# EAGLE design board (EAGLE 6.4)
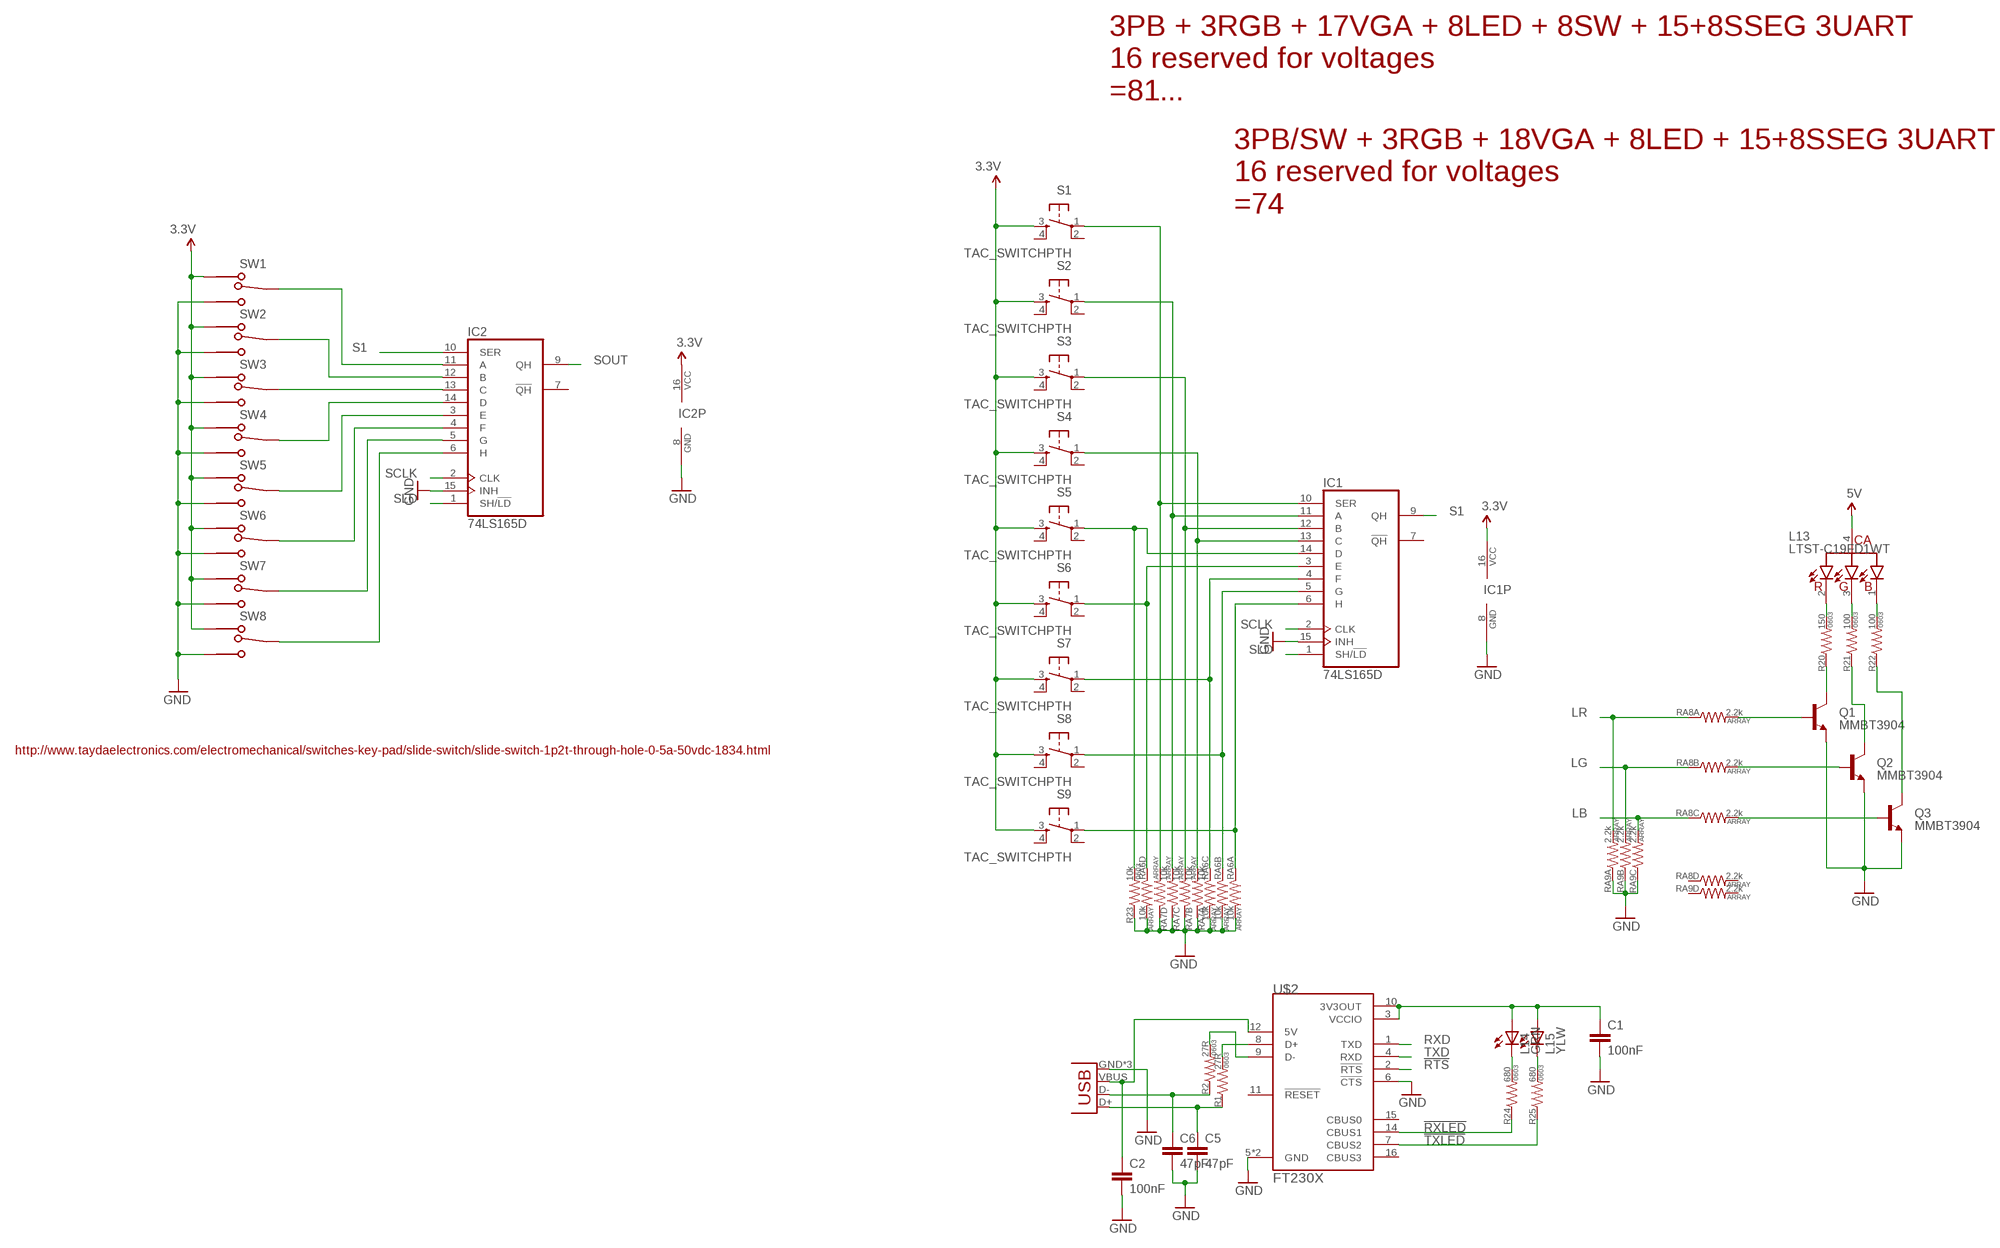
[diagram p0: schematic, sheet 1, part 1 of 3]
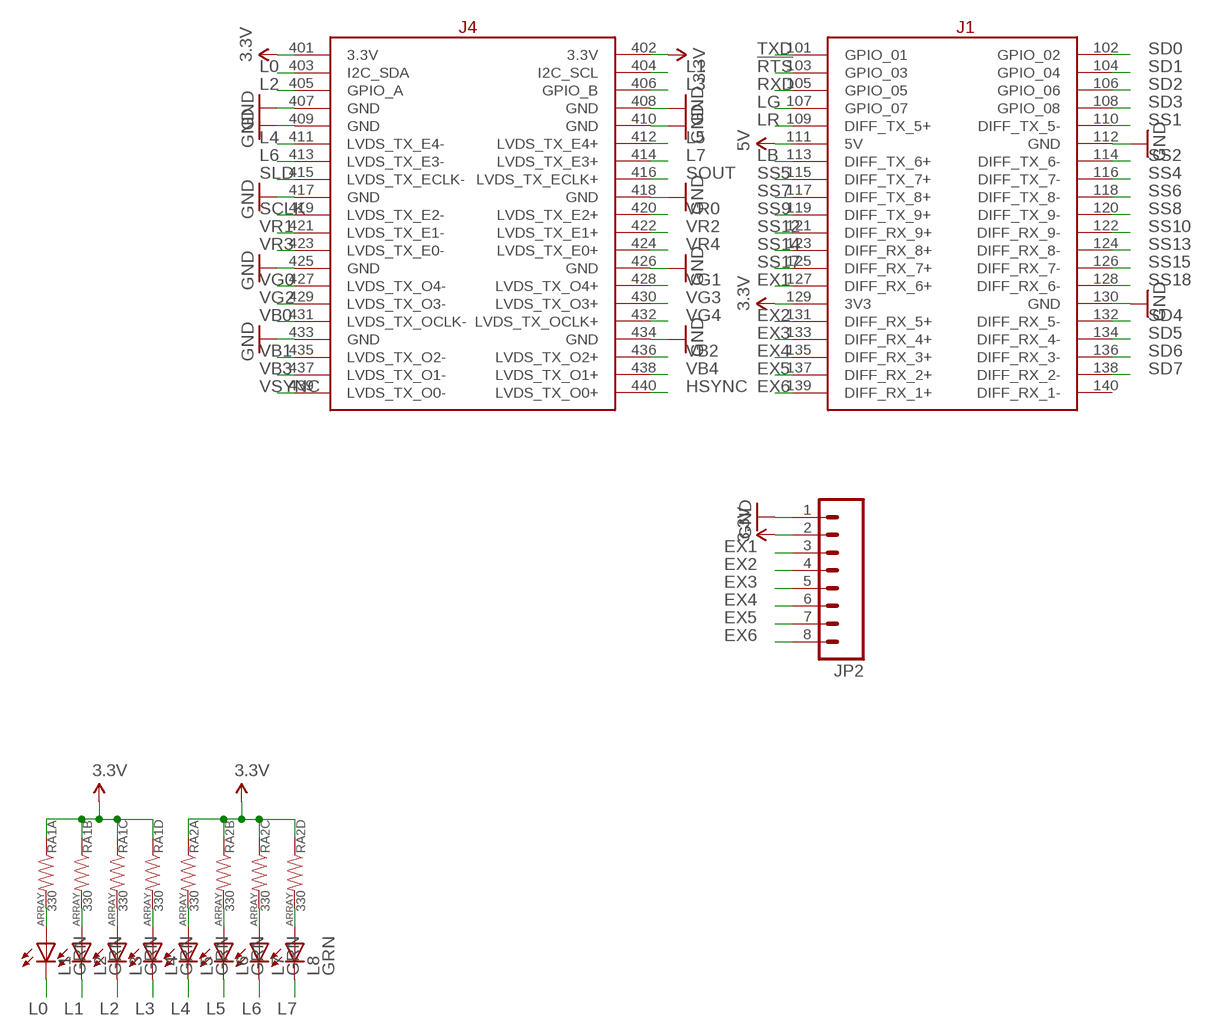
[diagram p1: schematic, sheet 1, part 2 of 3]
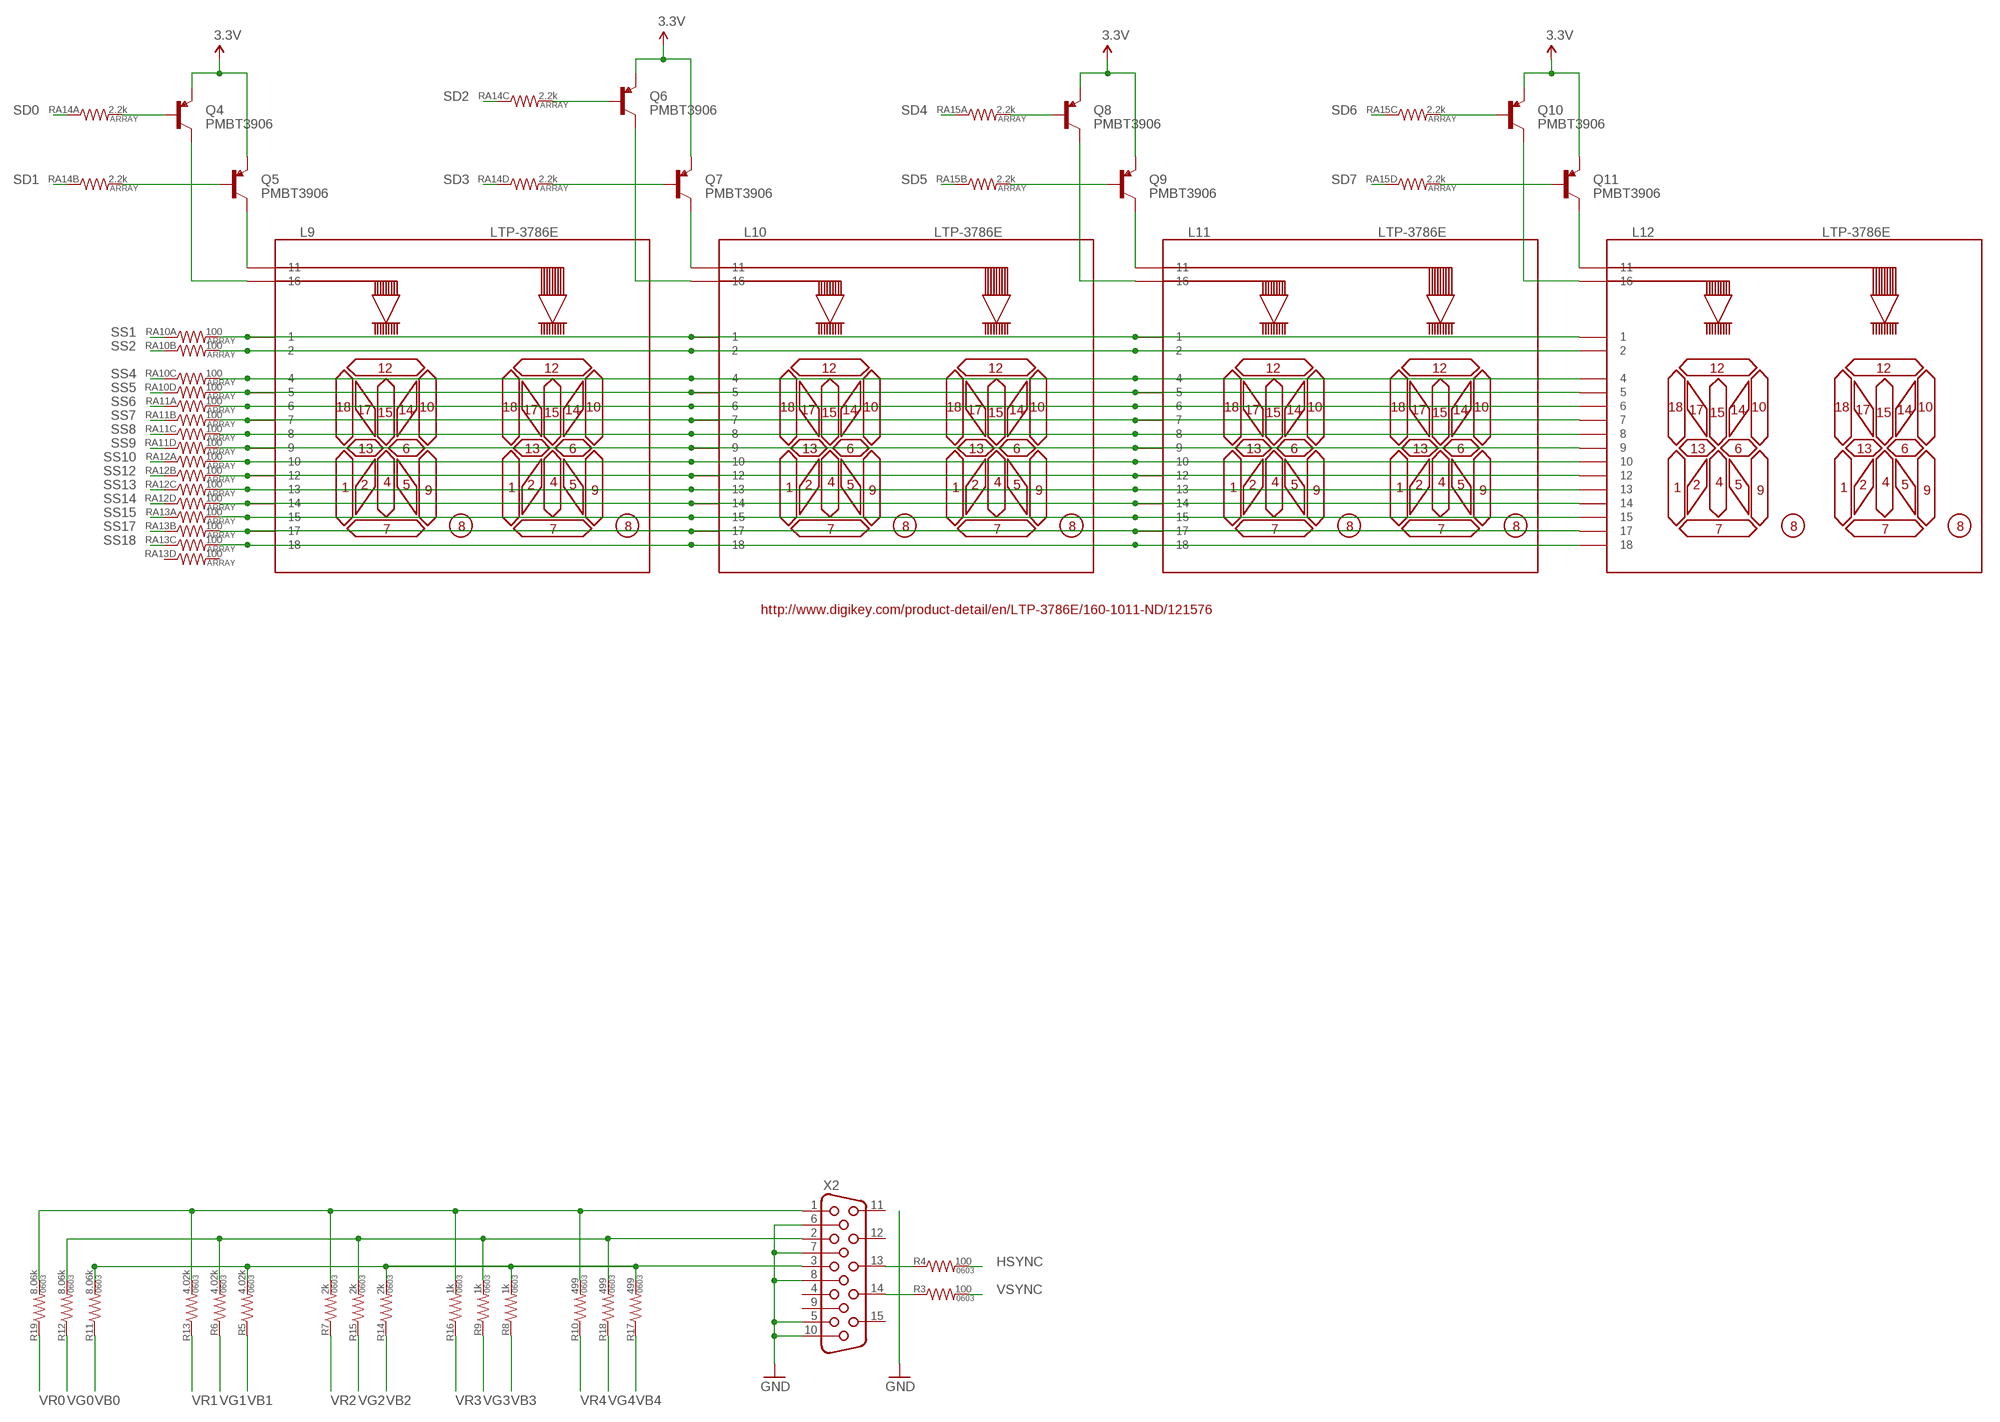
[diagram p2: schematic, sheet 1, part 3 of 3]

## Parts
C1  100nF  CAP0402-CAP  [0402-CAP]
C2  100nF  CAP0402-CAP  [0402-CAP]
C5  47pF  CAP0402-CAP  [0402-CAP]
C6  47pF  CAP0402-CAP  [0402-CAP]
IC1  74LS165D  [SO16]
IC2  74LS165D  [SO16]
JP1  USB-MICROB  [USB-MICROB]
JP2  M081X08  [1X08]
L1  GRN  LED0603  [0603_LED]
L2  GRN  LED0603  [0603_LED]
L3  GRN  LED0603  [0603_LED]
L4  GRN  LED0603  [0603_LED]
L5  GRN  LED0603  [0603_LED]
L6  GRN  LED0603  [0603_LED]
L7  GRN  LED0603  [0603_LED]
L8  GRN  LED0603  [0603_LED]
L9  LTP-3786E  LTP-3786  [LTP-378?]
L10  LTP-3786E  LTP-3786  [LTP-378?]
L11  LTP-3786E  LTP-3786  [LTP-378?]
L12  LTP-3786E  LTP-3786  [LTP-378?]
L13  LTST-C19FD1WT  LED_RGB  [LTST-C19F]
L14  GRN  LED0603  [0603_LED]
L15  YLW  LED0603  [0603_LED]
Q1  MMBT3904  TRANSISTOR_NPNSOT23  [SOT23]
Q2  MMBT3904  TRANSISTOR_NPNSOT23  [SOT23]
Q3  MMBT3904  TRANSISTOR_NPNSOT23  [SOT23]
Q4  PMBT3906  TRANSISTOR_PNPPMBT3906  [SOT23-3]
Q5  PMBT3906  TRANSISTOR_PNPPMBT3906  [SOT23-3]
Q6  PMBT3906  TRANSISTOR_PNPPMBT3906  [SOT23-3]
Q7  PMBT3906  TRANSISTOR_PNPPMBT3906  [SOT23-3]
Q8  PMBT3906  TRANSISTOR_PNPPMBT3906  [SOT23-3]
Q9  PMBT3906  TRANSISTOR_PNPPMBT3906  [SOT23-3]
Q10  PMBT3906  TRANSISTOR_PNPPMBT3906  [SOT23-3]
Q11  PMBT3906  TRANSISTOR_PNPPMBT3906  [SOT23-3]
R1  27R  RESISTOR0603  [0603-RES]
R2  27R  RESISTOR0603  [0603-RES]
R3  100  RESISTOR0603  [0603-RES]
R4  100  RESISTOR0603  [0603-RES]
R5  4.02k  RESISTOR0603  [0603-RES]
R6  4.02k  RESISTOR0603  [0603-RES]
R7  2k  RESISTOR0603  [0603-RES]
R8  1k  RESISTOR0603  [0603-RES]
R9  1k  RESISTOR0603  [0603-RES]
R10  499  RESISTOR0603  [0603-RES]
R11  8.06k  RESISTOR0603  [0603-RES]
R12  8.06k  RESISTOR0603  [0603-RES]
R13  4.02k  RESISTOR0603  [0603-RES]
R14  2k  RESISTOR0603  [0603-RES]
R15  2k  RESISTOR0603  [0603-RES]
R16  1k  RESISTOR0603  [0603-RES]
R17  499  RESISTOR0603  [0603-RES]
R18  499  RESISTOR0603  [0603-RES]
R19  8.06k  RESISTOR0603  [0603-RES]
R20  150  RESISTOR0603  [0603-RES]
R21  100  RESISTOR0603  [0603-RES]
R22  100  RESISTOR0603  [0603-RES]
R23  10k  RESISTOR0603  [0603-RES]
R24  680  RESISTOR0603  [0603-RES]
R25  680  RESISTOR0603  [0603-RES]
RA1  330  RESISTOR_ARRAY0603_X4  [0603-ARV]
RA2  330  RESISTOR_ARRAY0603_X4  [0603-ARV]
RA6  10k  RESISTOR_ARRAY0603_X4  [0603-ARV]
RA7  10k  RESISTOR_ARRAY0603_X4  [0603-ARV]
RA8  2.2k  RESISTOR_ARRAY0603_X4  [0603-ARV]
RA9  2.2k  RESISTOR_ARRAY0603_X4  [0603-ARV]
RA10  100  RESISTOR_ARRAY0603_X4  [0603-ARV]
RA11  100  RESISTOR_ARRAY0603_X4  [0603-ARV]
RA12  100  RESISTOR_ARRAY0603_X4  [0603-ARV]
RA13  100  RESISTOR_ARRAY0603_X4  [0603-ARV]
RA14  2.2k  RESISTOR_ARRAY0603_X4  [0603-ARV]
RA15  2.2k  RESISTOR_ARRAY0603_X4  [0603-ARV]
S1  TAC_SWITCHPTH  [TACTILE-PTH]
S2  TAC_SWITCHPTH  [TACTILE-PTH]
S3  TAC_SWITCHPTH  [TACTILE-PTH]
S4  TAC_SWITCHPTH  [TACTILE-PTH]
S5  TAC_SWITCHPTH  [TACTILE-PTH]
S6  TAC_SWITCHPTH  [TACTILE-PTH]
S7  TAC_SWITCHPTH  [TACTILE-PTH]
S8  TAC_SWITCHPTH  [TACTILE-PTH]
S9  TAC_SWITCHPTH  [TACTILE-PTH]
SW1  SWITCH_SPDT  [SWITCH_SLIDE_SPDT]
SW2  SWITCH_SPDT  [SWITCH_SLIDE_SPDT]
SW3  SWITCH_SPDT  [SWITCH_SLIDE_SPDT]
SW4  SWITCH_SPDT  [SWITCH_SLIDE_SPDT]
SW5  SWITCH_SPDT  [SWITCH_SLIDE_SPDT]
SW6  SWITCH_SPDT  [SWITCH_SLIDE_SPDT]
SW7  SWITCH_SPDT  [SWITCH_SLIDE_SPDT]
SW8  SWITCH_SPDT  [SWITCH_SLIDE_SPDT]
U$2  FT230X  [TSSOP16]
U$3  BEMICROCV_SHIELD  [BEMICROCV_SHIELD]
X2  HF15H  [HDF15H]

## Nets
3.3V: IC1.16(VCC) IC2.16(VCC) JP2.2 Q4.2(E) Q5.2(E) Q6.2(E) Q7.2(E) Q8.2(E) Q9.2(E) Q10.2(E) Q11.2(E) RA1.1 RA1.2 RA1.3 RA1.4 RA2.1 RA2.2 RA2.3 RA2.4 S1.3 S2.3 S3.3 S4.3 S5.3 S6.3 S7.3 S8.3 S9.3 SW1.P1 SW2.P1 SW3.P1 SW4.P1 SW5.P1 SW6.P1 SW7.P1 SW8.P1 U$3.129(3V3) U$3.401(3.3V) U$3.402(3.3V)
5V: L13.4(CA) U$3.111(5V)
!RTS: U$2.2(!RTS) U$3.103(GPIO_03)
!RXLED: R24.1 U$2.14(CBUS1)
!TXLED: R25.1 U$2.7(CBUS2)
EX1: JP2.3 U$3.127(DIFF_RX_6+)
EX2: JP2.4 U$3.131(DIFF_RX_5+)
EX3: JP2.5 U$3.133(DIFF_RX_4+)
EX4: JP2.6 U$3.135(DIFF_RX_3+)
EX5: JP2.7 U$3.137(DIFF_RX_2+)
EX6: JP2.8 U$3.139(DIFF_RX_1+)
GND: C1.2 C2.2 C5.2 C6.2 IC1.8(GND) IC1.15(INH) IC2.8(GND) IC2.15(INH) JP1.GND JP1.MT1(GND) JP1.MT2(GND) JP2.1 Q1.2(E) Q2.2(E) Q3.2(E) R23.1 RA6.5 RA6.6 RA6.7 RA6.8 RA7.1 RA7.2 RA7.3 RA7.4 RA9.1 RA9.2 RA9.3 SW1.P2 SW2.P2 SW3.P2 SW4.P2 SW5.P2 SW6.P2 SW7.P2 SW8.P2 U$2.5(GND) U$2.6(!CTS) U$2.13(GND) U$3.112(GND) U$3.130(GND) U$3.407(GND) U$3.408(GND) U$3.409(GND) U$3.410(GND) U$3.417(GND) U$3.418(GND) U$3.425(GND) U$3.426(GND) U$3.433(GND) U$3.434(GND) X2.5 X2.6 X2.7 X2.8 X2.10
HSYNC: R4.2 U$3.440(LVDS_TX_O0+)
L0: L1.C U$3.403(I2C_SDA)
L1: L2.C U$3.404(I2C_SCL)
L2: L3.C U$3.405(GPIO_A)
L3: L4.C U$3.406(GPIO_B)
L4: L5.C U$3.411(LVDS_TX_E4-)
L5: L6.C U$3.412(LVDS_TX_E4+)
L6: L7.C U$3.413(LVDS_TX_E3-)
L7: L8.C U$3.414(LVDS_TX_E3+)
LB: RA8.3 RA9.6 U$3.113(DIFF_TX_6+)
LG: RA8.2 RA9.7 U$3.107(GPIO_07)
LR: RA8.1 RA9.8 U$3.109(DIFF_TX_5+)
N$1: L1.A RA1.8
N$2: L2.A RA1.7
N$3: L3.A RA1.6
N$4: L4.A RA1.5
N$9: L5.A RA2.8
N$10: L6.A RA2.7
N$11: L7.A RA2.6
N$12: L8.A RA2.5
N$17: IC2.11(A) SW1.C
N$18: IC2.12(B) SW2.C
N$19: IC2.13(C) SW3.C
N$20: IC2.14(D) SW4.C
N$21: IC2.3(E) SW5.C
N$22: IC2.4(F) SW6.C
N$23: IC2.5(G) SW7.C
N$24: IC2.6(H) SW8.C
N$26: Q2.3(C) R21.1
N$27: Q3.3(C) R22.1
N$32: C6.1 JP1.D- R2.1
N$33: C5.1 JP1.D+ R1.1
N$34: R1.2 U$2.8(D+)
N$35: R2.2 U$2.9(D-)
N$36: L14.C R24.2
N$37: C2.1 JP1.VBUS U$2.12(5V)
N$38: C1.1 L14.A L15.A U$2.3(VCCIO) U$2.10(3V3OUT)
N$39: R3.1 X2.14
N$40: R4.1 X2.13
N$44: IC1.10(SER) RA7.5 S1.1
N$45: IC1.14(D) R23.2 S5.1
N$46: IC1.3(E) RA6.4 S6.1
N$47: IC1.4(F) RA6.3 S7.1
N$48: IC1.5(G) RA6.2 S8.1
N$49: L12.P$16 Q10.3(C)
N$50: IC1.11(A) RA7.6 S2.1
N$51: IC1.12(B) RA7.7 S3.1
N$52: IC1.13(C) RA7.8 S4.1
N$53: IC1.6(H) RA6.1 S9.1
N$55: L12.P$11 Q11.3(C)
N$57: Q1.1(B) RA8.8
N$58: Q2.1(B) RA8.7
N$59: Q3.1(B) RA8.6
N$63: L13.2(R) R20.2
N$64: L13.3(G) R21.2
N$65: L13.1(B) R22.2
N$66: Q1.3(C) R20.1
N$69: L11.P$11 Q9.3(C)
N$70: L11.P$16 Q8.3(C)
N$72: L9.P$1 L10.P$1 L11.P$1 L12.P$1 RA10.8
N$73: L9.P$2 L10.P$2 L11.P$2 L12.P$2 RA10.7
N$74: L10.P$11 Q7.3(C)
N$75: L9.P$4 L10.P$4 L11.P$4 L12.P$4 RA10.6
N$76: L9.P$5 L10.P$5 L11.P$5 L12.P$5 RA10.5
N$77: L9.P$6 L10.P$6 L11.P$6 L12.P$6 RA11.8
N$78: L9.P$7 L10.P$7 L11.P$7 L12.P$7 RA11.7
N$79: L9.P$8 L10.P$8 L11.P$8 L12.P$8 RA11.6
N$80: L9.P$9 L10.P$9 L11.P$9 L12.P$9 RA11.5
N$81: L9.P$10 L10.P$10 L11.P$10 L12.P$10 RA12.8
N$82: L9.P$12 L10.P$12 L11.P$12 L12.P$12 RA12.7
N$83: L9.P$13 L10.P$13 L11.P$13 L12.P$13 RA12.6
N$84: L9.P$14 L10.P$14 L11.P$14 L12.P$14 RA12.5
N$85: L9.P$15 L10.P$15 L11.P$15 L12.P$15 RA13.8
N$86: L9.P$17 L10.P$17 L11.P$17 L12.P$17 RA13.7
N$87: L9.P$18 L10.P$18 L11.P$18 L12.P$18 RA13.6
N$88: L10.P$16 Q6.3(C)
N$89: L15.C R25.2
N$90: L9.P$11 Q5.3(C)
N$91: L9.P$16 Q4.3(C)
N$93: Q10.1(B) RA15.6
N$94: Q11.1(B) RA15.5
N$95: Q8.1(B) RA15.8
N$96: Q9.1(B) RA15.7
N$97: Q6.1(B) RA14.6
N$98: Q7.1(B) RA14.5
N$99: Q4.1(B) RA14.8
N$100: Q5.1(B) RA14.7
RXD: U$2.1(TXD) U$3.105(GPIO_05)
S1: IC1.9(QH) IC2.10(SER)
SCLK: IC1.2(CLK) IC2.2(CLK) U$3.419(LVDS_TX_E2-)
SD0: RA14.1 U$3.102(GPIO_02)
SD1: RA14.2 U$3.104(GPIO_04)
SD2: RA14.3 U$3.106(GPIO_06)
SD3: RA14.4 U$3.108(GPIO_08)
SD4: RA15.1 U$3.132(DIFF_RX_5-)
SD5: RA15.2 U$3.134(DIFF_RX_4-)
SD6: RA15.3 U$3.136(DIFF_RX_3-)
SD7: RA15.4 U$3.138(DIFF_RX_2-)
SLD: IC1.1(SH/!LD) IC2.1(SH/!LD) U$3.415(LVDS_TX_ECLK-)
SOUT: IC2.9(QH) U$3.416(LVDS_TX_ECLK+)
SS1: RA10.1 U$3.110(DIFF_TX_5-)
SS2: RA10.2 U$3.114(DIFF_TX_6-)
SS4: RA10.3 U$3.116(DIFF_TX_7-)
SS5: RA10.4 U$3.115(DIFF_TX_7+)
SS6: RA11.1 U$3.118(DIFF_TX_8-)
SS7: RA11.2 U$3.117(DIFF_TX_8+)
SS8: RA11.3 U$3.120(DIFF_TX_9-)
SS9: RA11.4 U$3.119(DIFF_TX_9+)
SS10: RA12.1 U$3.122(DIFF_RX_9-)
SS12: RA12.2 U$3.121(DIFF_RX_9+)
SS13: RA12.3 U$3.124(DIFF_RX_8-)
SS14: RA12.4 U$3.123(DIFF_RX_8+)
SS15: RA13.1 U$3.126(DIFF_RX_7-)
SS17: RA13.2 U$3.125(DIFF_RX_7+)
SS18: RA13.3 U$3.128(DIFF_RX_6-)
TXD: U$2.4(RXD) U$3.101(GPIO_01)
VB0: R11.1 U$3.431(LVDS_TX_OCLK-)
VB1: R5.1 U$3.435(LVDS_TX_O2-)
VB2: R14.1 U$3.436(LVDS_TX_O2+)
VB3: R8.1 U$3.437(LVDS_TX_O1-)
VB4: R17.1 U$3.438(LVDS_TX_O1+)
VBOUT: R5.2 R8.2 R11.2 R14.2 R17.2 X2.3
VG0: R12.1 U$3.427(LVDS_TX_O4-)
VG1: R6.1 U$3.428(LVDS_TX_O4+)
VG2: R15.1 U$3.429(LVDS_TX_O3-)
VG3: R9.1 U$3.430(LVDS_TX_O3+)
VG4: R18.1 U$3.432(LVDS_TX_OCLK+)
VGOUT: R6.2 R9.2 R12.2 R15.2 R18.2 X2.2
VR0: R19.1 U$3.420(LVDS_TX_E2+)
VR1: R13.1 U$3.421(LVDS_TX_E1-)
VR2: R7.1 U$3.422(LVDS_TX_E1+)
VR3: R16.1 U$3.423(LVDS_TX_E0-)
VR4: R10.1 U$3.424(LVDS_TX_E0+)
VROUT: R7.2 R10.2 R13.2 R16.2 R19.2 X2.1
VSYNC: R3.2 U$3.439(LVDS_TX_O0-)
Unconnected: IC1.7(!QH) IC2.7(!QH) RA8.4 RA8.5 RA9.4 RA9.5 RA13.4 RA13.5 S1.2 S1.4 S2.2 S2.4 S3.2 S3.4 S4.2 S4.4 S5.2 S5.4 S6.2 S6.4 S7.2 S7.4 S8.2 S8.4 S9.2 S9.4 U$2.11(!RESET) U$2.15(CBUS0) U$2.16(CBUS3) U$3.140(DIFF_RX_1-) X2.4 X2.9 X2.11 X2.12 X2.15

## Notes on the sheet
- 3PB + 3RGB + 17VGA + 8LED + 8SW + 15+8SSEG 3UART
  16 reserved for voltages
  =81...
- 3PB/SW + 3RGB + 18VGA + 8LED + 15+8SSEG 3UART
  16 reserved for voltages
  =74
- http://www.digikey.com/product-detail/en/LTP-3786E/160-1011-ND/121576
- http://www.taydaelectronics.com/electromechanical/switches-key-pad/slide-switch/slide-switch-1p2t-through-hole-0-5a-50vdc-1834.html

## Library data of the parts
C1 C2 C5 C6 = kmod-passives:CAP: Capacitor Standard 0603 ceramic capacitor, and 0.1" leaded capacitor.
IC1 IC2 = 74xx-us:74*165: 8-bit parallel load SHIFT REGISTER
JP1 = SparkFun-Connectors:USB: USB Connectors USB-B-PTH is fully proven SKU : PRT-00139/CONN-08278 USB-miniB is fully proven SKU : PRT-00587 USB-A-PCB is untested. USB-A-H is throughly reviewed, but untested. Spark Fun Electronics SKU : PRT-00437 USB-B-SMT is throughly reviewed, but untested. Needs silkscreen touching up. USB-A-S has not been used/tested USB-MB-H has not been used/tested USB-MICROB has been used. CONN-09505; PROD_ID: CONN-09505
JP2 = SparkFun-Connectors:M08: Header 8 Standard 8-pin 0.1" header. Use with straight break away headers (SKU : PRT-00116), right angle break away headers (PRT-00553), swiss pins (PRT-00743), machine pins (PRT-00117), and female headers (PRT-00115).
L1-L8 L14 L15 = kmod-passives:LED
L9-L12 = kmod-testing:LTP-3786
L13 = kmod-passives:LED_RGB
Q1-Q3 = SparkFun-DiscreteSemi:TRANSISTOR_NPN: Generic NPN BJT MMBT2222A - TRANS-08049 (SOT-23, 1A 40V) MPSA42 - TRANS-09116 (SOT-23, 500mA 300V) MMBT5088LT1G - TRANS-11160 (SOT-23, 50 mA 30V) BC547 - COM-08928 <http://www.sparkfun.com/products/8928> (TO-92 45V 100mA) (1.Collector 2.Base 3.Emitter) 2N3904 - COM-00521 <http://www.sparkfun.com/products/521> (TO-92 40V 200mA) (1.Emitter 2.Base 3.Collector) P2N2222A - COM-12852 <http://www.sparkfun.com/products/12852> (TO-92 40V 600mA) (1.Collector 2.Base 3.Emitter)
Q4-Q11 = SparkFun-DiscreteSemi:TRANSISTOR_PNP: Generic PNP BJT Double check pinouts against datasheets- not all devices are the same! MMBT3906 - 40V 200mA SOT-23 (TRANS-08052) MMBT4403 - 40V 600mA SOT-23 (TRANS-09245); PROD_ID: TRANS-08052
R1-R25 = kmod-passives:RESISTOR: Resistor Basic schematic elements and footprints for 0603, 1206, and PTH resistors.; PACKAGE: 0603
RA1 RA2 RA6-RA15 = kmod-passives:RESISTOR_ARRAY; PACKAGE: ARRAY
S1-S9 = kmod-mechanical:TAC_SWITCH: Momentary Switch Button commonly used for reset or general input. Spark Fun Electronics SKU : COM-00097 SMT- SWCH-08247
SW1-SW8 = kmod-mechanical:SWITCH_SPDT
U$2 = kmod-testing:FT230X
U$3 = kmod-testing:BEMICROCV_SHIELD
X2 = con-subd:HF15: SUB-D; OC_FARNELL: unknown; OC_NEWARK: unknown

## Board
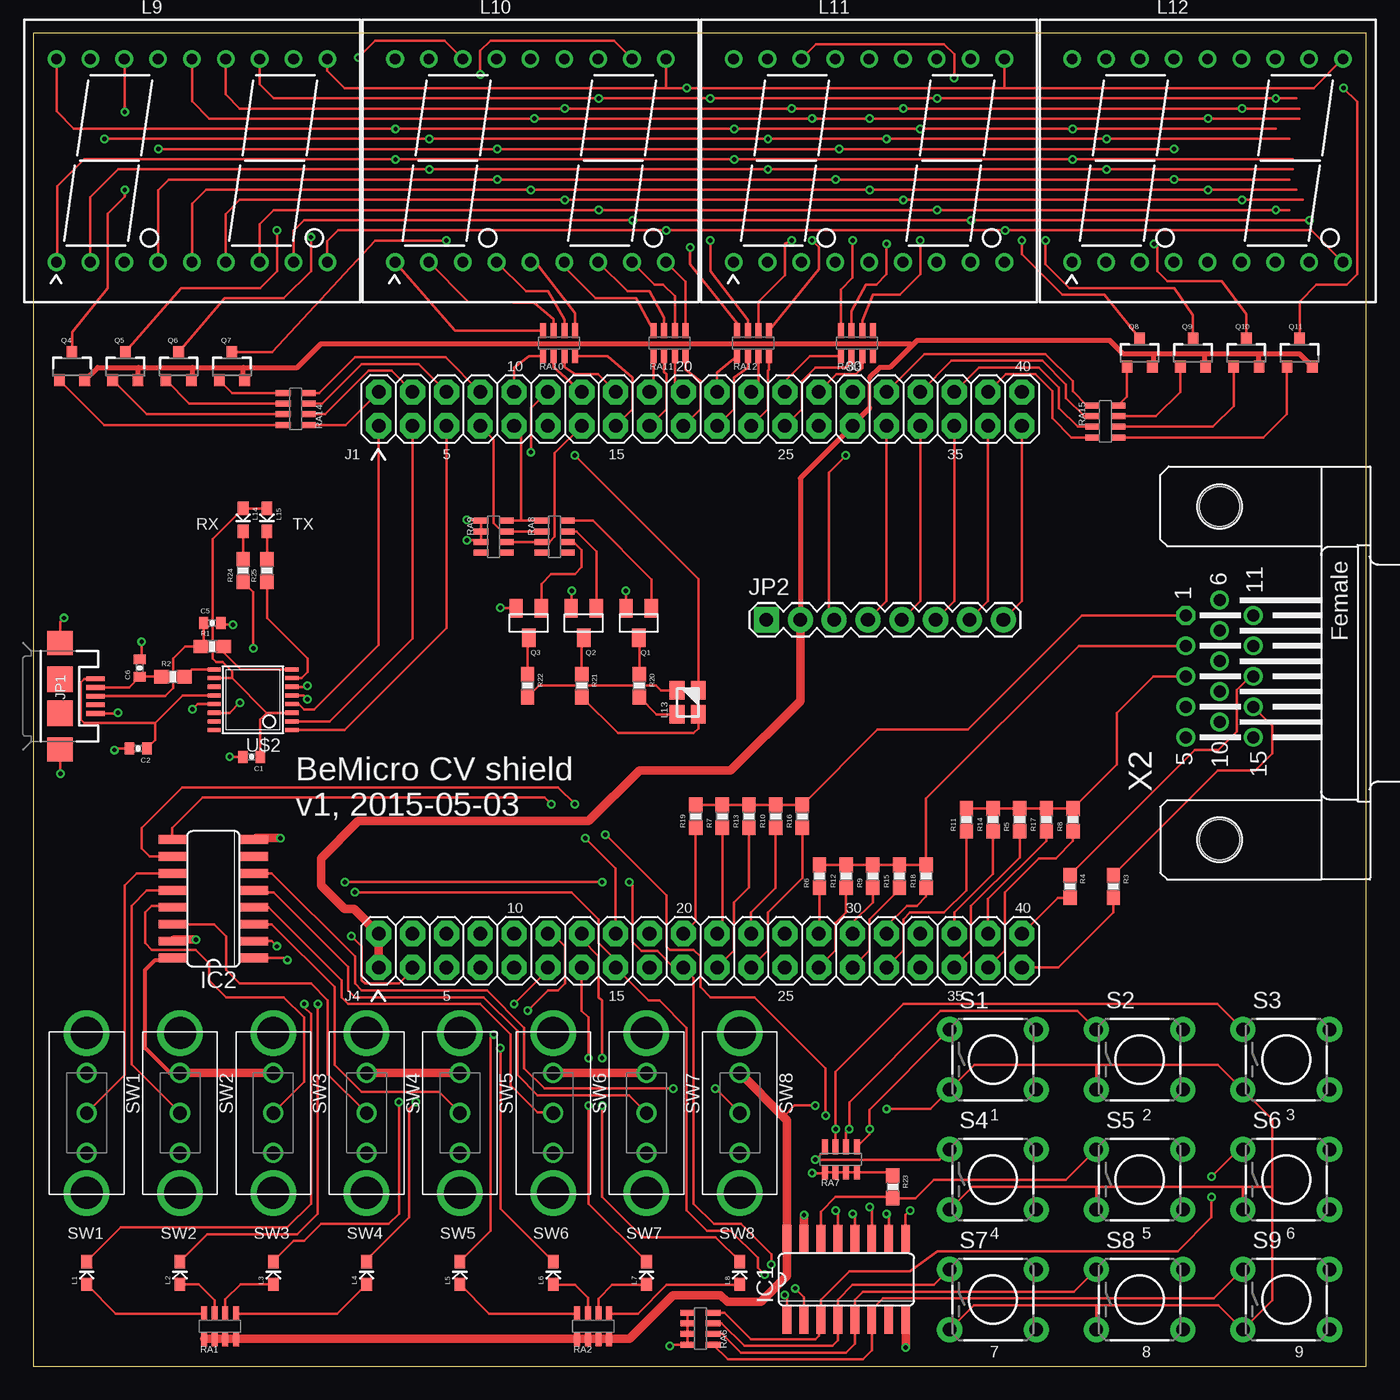
[diagram p3: board, top side]
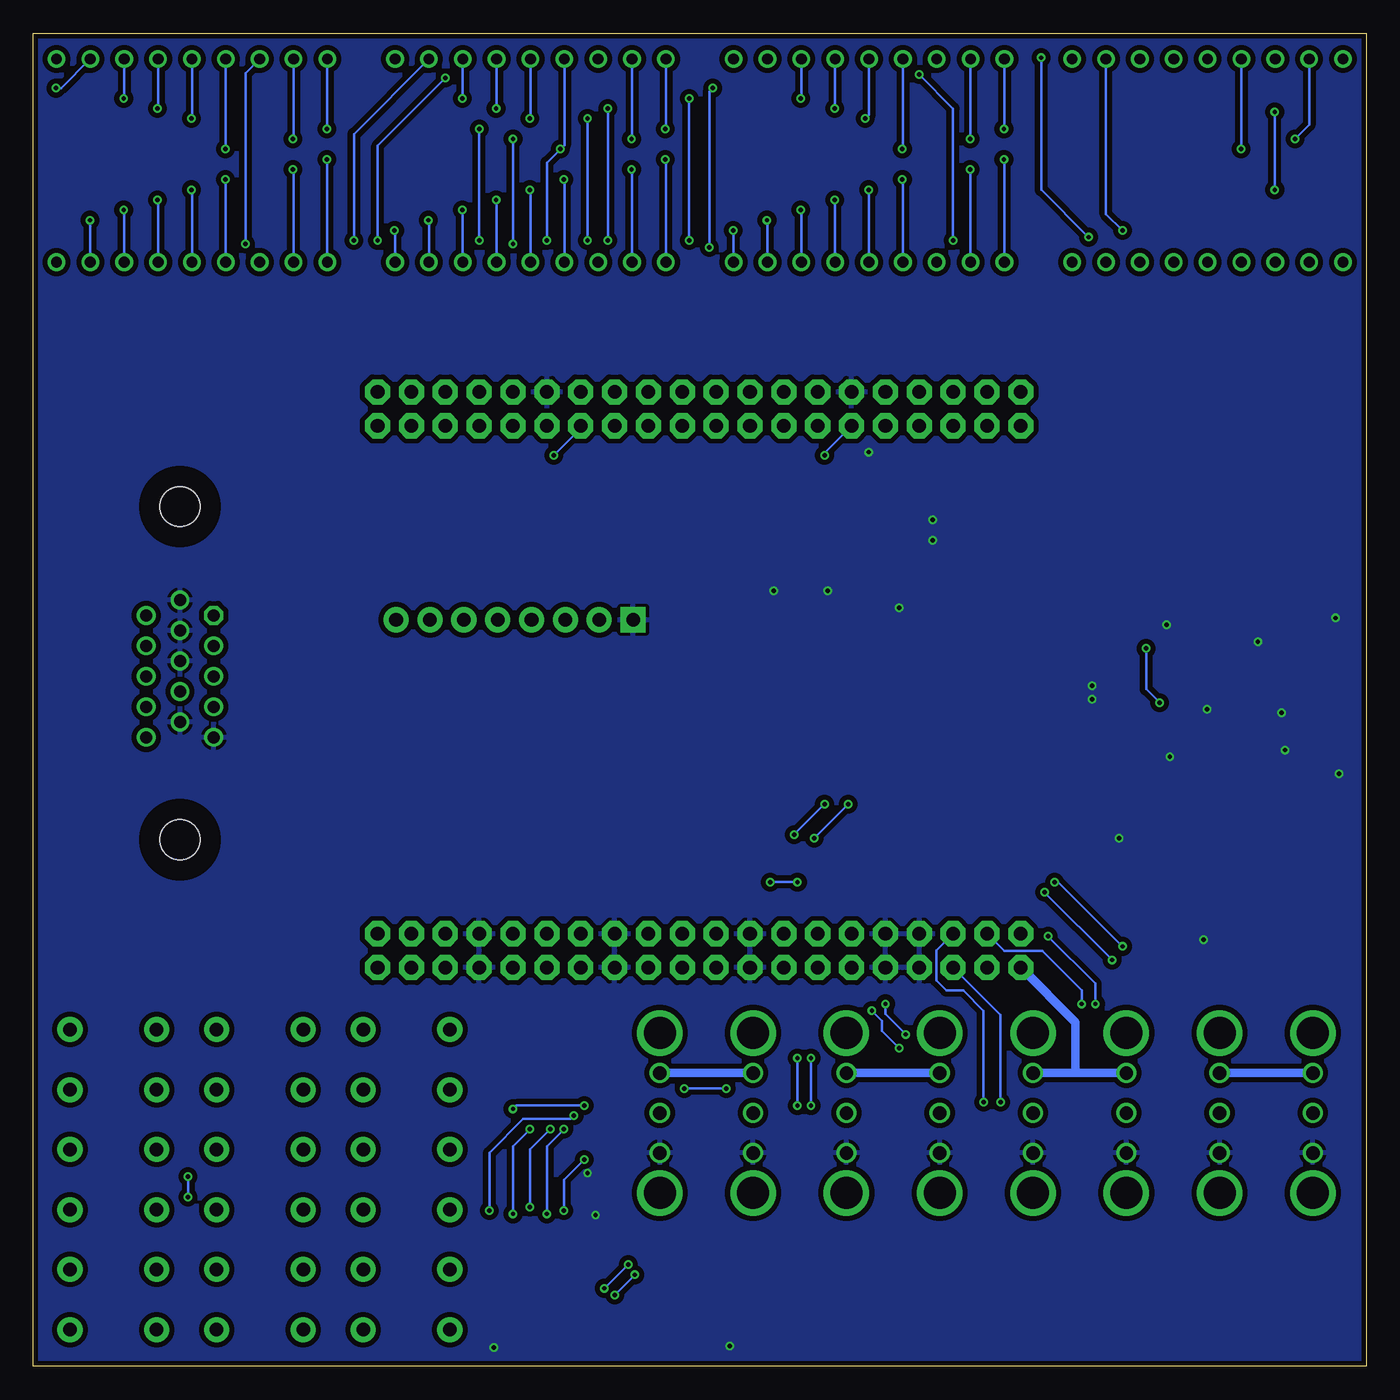
[diagram p4: board, bottom side, seen from below]

Size 100 x 100 mm. Coordinates in mm from the lower left corner, seen from the top.
Outline: 0,0 100,0 100,100 0,100 0,0
Copper layers (1*16): Top 0.035mm / dielectric 1.5mm / Bottom 0.035mm
Design rules "dirt_cheap_dirty_boards.v1": minimum track width 5mil, minimum drill 12mil, track to track 5mil, track to pad 5mil, pad to pad 5mil, via to via 5mil, smd to smd 0mil, copper to edge 10mil, drill to drill 10mil, minimum pad ring 10mil, minimum via ring 6mil, stop-mask expansion 2mil, vias tented up to drill 25mil, thermal gap 10mil

### Footprints (pad centres in the part's own frame; a part is rotated, then mirrored left to right if it is on the bottom)
0402-CAP = smd 0.7 x 0.9: 1 -0.65,0; 2 0.65,0
SO16 = smd 0.66 x 2.032: 1 -4.445,-3.073; 2 -3.175,-3.073; 3 -1.905,-3.073; 4 -0.635,-3.073; 5 0.635,-3.073; 6 1.905,-3.073; 7 3.175,-3.073; 8 4.445,-3.073; 9 4.445,3.073; 10 3.175,3.073; 11 1.905,3.073; 12 0.635,3.073; 13 -0.635,3.073; 14 -1.905,3.073; 15 -3.175,3.073; 16 -4.445,3.073
USB-MICROB = smd 0.35 x 1.4: D+ 0,2.65; D- -0.65,2.65; GND 1.3,2.65; ID 0.65,2.65; VBUS -1.3,2.65 | smd 1.8 x 1.9: MT1 -4,0; MT2 4,0 | smd 1.9 x 1.9: P$1 -1.27,0; P$2 1.27,0
1X08 = drill 1.016 pad 1.88 square: 1 0,0 | drill 1.016 pad 1.88: 2 2.54,0; 3 5.08,0; 4 7.62,0; 5 10.16,0; 6 12.7,0; 7 15.24,0; 8 17.78,0
0603_LED = smd 0.8 x 1.003: A 0,-0.852; C 0,0.852
LTP-378? = drill 0.813: P$1 -10.16,-7.62; P$2 -7.62,-7.62; P$3 -5.08,-7.62; P$4 -2.54,-7.62; P$5 0,-7.62; P$6 2.54,-7.62; P$7 5.08,-7.62; P$8 7.62,-7.62; P$9 10.16,-7.62; P$10 10.16,7.62; P$11 7.62,7.62; P$12 5.08,7.62; P$13 2.54,7.62; P$14 0,7.62; P$15 -2.54,7.62; P$16 -5.08,7.62; P$17 -7.62,7.62; P$18 -10.16,7.62
LTST-C19F = smd 1.4 x 1.1: 1 0.9,0.8; 2 -0.9,0.8; 3 -0.9,-0.8; 4 0.9,-0.8
SOT23 = smd 1 x 1.4: 1 -0.95,-1.1; 2 0.95,-1.1; 3 0,1.1
SOT23-3 = smd 0.8 x 0.9: 1 -0.95,-1; 2 0.95,-1; 3 0,1.1
0603-RES = smd 1.1 x 1: 1 -0.85,0; 2 0.85,0
0603-ARV = smd 0.45 x 1.1: 1 -1.2,-0.95; 2 -0.4,-0.95; 3 0.4,-0.95; 4 1.2,-0.95; 5 1.2,0.95; 6 0.4,0.95; 7 -0.4,0.95; 8 -1.2,0.95
TACTILE-PTH = drill 1.016 pad 1.88: 1 -3.251,2.261; 2 3.251,2.261; 3 -3.251,-2.261; 4 3.251,-2.261
SWITCH_SLIDE_SPDT = drill 1: C 0,0; P1 -3,0; P2 3,0 | drill 2.4: MNT1 -6,0; MNT2 6,0
TSSOP16 = smd 0.305 x 0.991: 1 -2.275,-2.918; 2 -1.625,-2.918; 3 -0.975,-2.918; 4 -0.325,-2.918; 5 0.325,-2.918; 6 0.975,-2.918; 7 1.625,-2.918; 8 2.275,-2.918; 9 2.275,2.918; 10 1.625,2.918; 11 0.975,2.918; 12 0.325,2.918; 13 -0.325,2.918; 14 -0.975,2.918; 15 -1.625,2.918; 16 -2.275,2.918
BEMICROCV_SHIELD = drill 1.016 pad 1.88 octagon: 101 -23.09,20.55; 102 -23.09,23.09; 103 -20.55,20.55; 104 -20.55,23.09; 105 -18.01,20.55; 106 -18.01,23.09; 107 -15.47,20.55; 108 -15.47,23.09; 109 -12.93,20.55; 110 -12.93,23.09; 111 -10.39,20.55; 112 -10.39,23.09; 113 -7.85,20.55; 114 -7.85,23.09; 115 -5.31,20.55; 116 -5.31,23.09; 117 -2.77,20.55; 118 -2.77,23.09; 119 -0.23,20.55; 120 -0.23,23.09; 121 2.31,20.55; 122 2.31,23.09; 123 4.85,20.55; 124 4.85,23.09; 125 7.39,20.55; 126 7.39,23.09; 127 9.93,20.55; 128 9.93,23.09; 129 12.47,20.55; 130 12.47,23.09; 131 15.01,20.55; 132 15.01,23.09; 133 17.55,20.55; 134 17.55,23.09; 135 20.09,20.55; 136 20.09,23.09; 137 22.63,20.55; 138 22.63,23.09; 139 25.17,20.55; 140 25.17,23.09; 401 -23.09,-20.09; 402 -23.09,-17.55; 403 -20.55,-20.09; 404 -20.55,-17.55; 405 -18.01,-20.09; 406 -18.01,-17.55; 407 -15.47,-20.09; 408 -15.47,-17.55; 409 -12.93,-20.09; 410 -12.93,-17.55; 411 -10.39,-20.09; 412 -10.39,-17.55; 413 -7.85,-20.09; 414 -7.85,-17.55; 415 -5.31,-20.09; 416 -5.31,-17.55; 417 -2.77,-20.09; 418 -2.77,-17.55; 419 -0.23,-20.09; 420 -0.23,-17.55; 421 2.31,-20.09; 422 2.31,-17.55; 423 4.85,-20.09; 424 4.85,-17.55; 425 7.39,-20.09; 426 7.39,-17.55; 427 9.93,-20.09; 428 9.93,-17.55; 429 12.47,-20.09; 430 12.47,-17.55; 431 15.01,-20.09; 432 15.01,-17.55; 433 17.55,-20.09; 434 17.55,-17.55; 435 20.09,-20.09; 436 20.09,-17.55; 437 22.63,-20.09; 438 22.63,-17.55; 439 25.17,-20.09; 440 25.17,-17.55
HDF15H = drill 0.9 octagon: 1 4.329,2.54 | drill 0.9: 2 2.043,2.54; 3 -0.243,2.54; 4 -2.529,2.54; 5 -4.815,2.54; 6 5.472,0; 7 3.186,0; 8 0.9,0; 9 -1.386,0; 10 -3.672,0; 11 4.329,-2.54; 12 2.043,-2.54; 13 -0.243,-2.54; 14 -2.529,-2.54; 15 -4.815,-2.54 | hole 3: -12.5,0; 12.5,0

### Placement (x,y rotation side)
C1  16.38,45.72 180 top
C2  7.87,46.35 180 top
C5  13.43,55.75 0 top
C6  7.99,52.39 90 top
IC1  61,6.51 0 top
IC2  13.51,35.07 90 top
JP1  2,50.27 270 top
JP2  55,56 0 top
L1  4,7 0 top
L2  11,7 0 top
L3  18,7 0 top
L4  25,7 0 top
L5  32,7 0 top
L6  39,7 0 top
L7  46,7 0 top
L8  53,7 0 top
L9  11.9,90.45 0 top
L10  37.3,90.45 0 top
L11  62.7,90.45 0 top
L12  88.1,90.45 0 top
L13  49.09,49.81 90 top
L14  15.75,63.5 180 top
L15  17.53,63.5 180 top
Q1  45.42,55.76 180 top
Q2  41.3,55.76 180 top
Q3  37.17,55.76 180 top
Q4  2.9,74.97 0 top
Q5  6.9,74.97 0 top
Q6  10.9,74.97 0 top
Q7  14.9,74.97 0 top
Q8  83,76 0 top
Q9  87,76 0 top
Q10  91,76 0 top
Q11  95,76 0 top
R1  13.43,54 0 top
R2  10.48,51.73 0 top
R3  81.03,36 270 top
R4  77.78,36 270 top
R5  74,41 90 top
R6  58.98,36.76 90 top
R7  51.7,41.25 90 top
R8  78,41 90 top
R9  62.98,36.76 90 top
R10  55.7,41.25 90 top
R11  70,41 90 top
R12  60.98,36.76 90 top
R13  53.7,41.25 90 top
R14  72,41 90 top
R15  64.98,36.76 90 top
R16  57.7,41.25 90 top
R17  76,41 90 top
R18  66.98,36.76 90 top
R19  49.7,41.25 90 top
R20  45.47,51.05 270 top
R21  41.15,51.05 270 top
R22  37.08,51.05 270 top
R23  64.48,13.45 270 top
R24  15.75,59.69 90 top
R25  17.53,59.69 90 top
RA1  14,3 0 top
RA2  42,3 0 top
RA6  50.05,2.82 90 top
RA7  60.58,15.5 0 top
RA8  39.12,62.23 270 top
RA9  34.54,62.23 270 top
RA10  39.44,76.75 0 top
RA11  47.73,76.75 0 top
RA12  54,76.75 0 top
RA13  61.79,76.75 0 top
RA14  19.69,71.82 90 top
RA15  80.43,70.88 270 top
S1  72,23 0 top
S2  83,23 0 top
S3  94,23 0 top
S4  72,14 0 top
S5  83,14 0 top
S6  94,14 0 top
S7  72,5 0 top
S8  83,5 0 top
S9  94,5 0 top
SW1  4,19 270 top
SW2  11,19 270 top
SW3  18,19 270 top
SW4  25,19 270 top
SW5  32,19 270 top
SW6  39,19 270 top
SW7  46,19 270 top
SW8  53,19 270 top
U$2  16.48,50 90 top
U$3  49,50 0 top
X2  89,52 90 top

### Tracks (layer width: path | path; a pad name or v marks a point on that pad's centre or on a via)
3.3V  (via drill 0.33)
  Top 0.203: S7.3 70.58,4.57 79.76,4.57 | 79.76,4.57 88.92,4.57 S9.3 92.96,4.96 92.96,13.46 | S4.3 70.47,13.46 79.76,13.46 | 79.76,13.46 90.68,13.46 | 90.68,13.46 92.96,13.46 | S5.3 79.75,13.46 79.76,13.46 | S8.3 79.75,4.57 79.76,4.57 | 79.76,22.61 70.61,22.61 S1.3 67.31,19.3 v64.01,19.3 | 79.76,22.61 88.88,22.61 S3.3 92.96,18.52 92.96,13.46 | S2.3 79.75,22.6 79.76,22.61 | S6.3 90.75,13.39 90.68,13.46 | 56.28,18.72 57.12,19.56 v58.67,19.56
  Top 0.254: 62.74,74.17 62.74,71.88
  Top 0.305: SW2.P1 10.26,22 8.38,23.88 8.38,29.72 9.14,30.48 10.16,30.48 10.3,30.62 IC2.16
  Top 0.381: Q11.2 95,75.95 91.95,75.95 | 91.95,75.95 87.88,75.95 | 87.88,75.95 84.07,75.95 | 84.07,75.95 81.79,75.95 80.77,76.96 66.29,76.96 65.91,76.58 | Q10.2 91.95,75.95 | Q9.2 87.88,75.07 87.88,75.95 | Q8.2 84.07,75.12 84.07,75.95 | 65.91,76.58 64.26,74.93 63.5,74.93 62.74,74.17 | 62.74,71.88 61.47,70.61 U$3.129 57.54,66.62 JP2.2 | Q4.2 4.82,74.93 7.87,74.93 | 7.87,74.93 11.94,74.93 | 11.94,74.93 15.75,74.93 | Q5.2 7.87,73.99 7.87,74.93 | Q6.2 11.94,74.05 11.94,74.93 | Q7.2 15.75,74.07 15.75,74.93 | 15.75,74.93 19.81,74.93 21.59,76.71 65.79,76.71 65.91,76.58
  Top 0.635: SW2.P1 SW3.P1 | SW4.P1 SW5.P1 | SW6.P1 SW7.P1 | SW8.P1 56.28,18.72 56.55,18.45 IC1.16 56.55,6.77 54.61,4.83 52.07,4.83 51.56,5.33 48.01,5.33 44.72,2.05 RA2.4 RA2.3 RA2.2 RA2.1 RA1.4 RA1.3 RA1.2 RA1.1 | U$3.401 U$3.402 24.07,34.29 23.37,34.29 21.59,36.07 21.59,38.1 24.38,40.89 41.66,40.89 45.47,44.7 52.32,44.7 57.54,49.92 JP2.2
  Bottom 0.203: v58.67,19.56 63.75,19.56 v64.01,19.3
  Bottom 0.635: SW1.P1 SW2.P1 | SW3.P1 21.8,22 | 21.8,22 SW4.P1 | SW5.P1 SW6.P1 | SW7.P1 SW8.P1 | 21.8,22 21.8,25.8 U$3.401
5V  (via drill 0.33)
  Top 0.203: L13.4 49.89,59.07 v40.64,68.33
  Bottom 0.203: v40.64,68.33 40.64,68.52 U$3.111
!RTS
  Top 0.203: U$2.2 22.21,48.38 28.45,54.61 U$3.103
!RXLED  (via drill 0.33)
  Top 0.203: U$2.14 14.73,49.02 v15.49,49.78 | v16.51,53.85 16.51,58.08 R24.1
  Bottom 0.203: v15.49,49.78 16.51,50.8 v16.51,53.85
!TXLED
  Top 0.203: U$2.7 20.13,51.62 20.57,52.07 20.57,53.09 17.53,56.13 R25.1
EX1  (via drill 0.33)
  Top 0.203: JP2.3 59.69,56.39 59.69,67.06 v60.96,68.33
  Bottom 0.203: v60.96,68.33 58.93,70.36 U$3.127
EX2
  Top 0.203: U$3.131 64.01,57.39 JP2.4
EX3
  Top 0.203: U$3.133 66.55,57.39 JP2.5
EX4
  Top 0.203: U$3.135 69.09,57.39 JP2.6
EX5
  Top 0.203: U$3.137 71.63,57.39 JP2.7
EX6
  Top 0.203: U$3.139 74.17,57.39 JP2.8
GND  (via drill 0.33)
  Top 0.203: R23.1 64.23,14.55 RA7.4 RA7.3 RA7.2 RA7.1 59.31,14.48 v58.42,14.48 | JP1.GND 6.3,48.97 v6.35,49.02 | JP1.MT2 2,44.48 v2.03,44.45 | JP1.MT1 2,55.85 v2.29,56.13 | C6.2 8.13,53.17 v8.13,54.36 | C5.2 14.2,55.63 v14.99,55.63 | U$2.13 12.34,49.67 v11.94,49.28 | U$2.6 20.5,50.98 v20.57,51.05 | U$2.5 20.29,50.33 v20.57,50.04 | v32.51,61.98 33.45,61.98 RA9.3 RA9.2 RA9.1 33.52,63.5 v32.51,63.5 | Q3.2 36.18,56.9 v35.05,56.9 | Q2.2 40.39,56.9 v40.39,58.17 | Q1.2 44.45,56.88 v44.45,58.17 | RA6.5 RA6.6 RA6.7 RA6.8 47.85,1.62 v47.75,1.52 | v37.34,68.58 37.34,71.88 38.61,73.15 | C2.2 6.22,46.35 v6.1,46.23 | C1.2 v14.73,45.72
  Top 0.635: IC1.15 v57.82,11.35 | IC1.8 v65.45,1.39 | IC2.8 16.7,39.62 v18.54,39.62 | IC2.15 10.55,32 v12.19,32
  pour Bottom (isolate 0.381): -12.7,114.3 114.3,114.3 114.3,-12.7 -12.7,-12.7
HSYNC
  Top 0.203: U$3.440 76.87,35.15 R4.2
L0  (via drill 0.33)
  Top 0.203: L1.C 6.56,10.41 19.05,10.41 20.83,12.19 20.83,26.42 20.32,26.92 v20.32,27.18 | v23.88,32.26 24.64,31.5 24.64,28.96 24.89,28.7 27.43,28.7 28.45,29.72 U$3.403
  Bottom 0.203: v20.32,27.18 20.32,28.7 v23.88,32.26
L1  (via drill 0.33)
  Top 0.203: L2.C 13.05,9.91 19.81,9.91 21.34,11.43 v21.34,27.18
  Bottom 0.203: v21.34,27.18 21.34,28.19 24.29,31.15 27.15,31.15 U$3.404
L2  (via drill 0.33)
  Top 0.203: L3.C 19.55,9.4 20.32,9.4 21.59,10.67 26.67,10.67 27.43,11.43 v27.43,19.81
  Bottom 0.203: v27.43,19.81 27.43,26.35 U$3.405
L3  (via drill 0.33)
  Top 0.203: L4.C 25,7.98 28.19,11.18 28.19,19.3 v28.7,19.81
  Bottom 0.203: v28.7,19.81 28.7,26.67 30.23,28.19 31.5,28.19 32.26,28.96 32.26,31.18 U$3.406
L4  (via drill 0.33)
  Top 0.203: L5.C 34.3,10.15 34.3,24.65 v34.54,24.89 | v36.07,27.18 38.61,29.72 U$3.411
  Bottom 0.203: v34.54,24.89 36.07,26.42 v36.07,27.18
L5  (via drill 0.33)
  Top 0.203: L6.C 35.05,11.8 v35.05,23.88 | v37.08,26.67 38.61,28.19 39.37,28.19 39.88,28.7 39.88,31.5 38.92,32.45 U$3.412
  Bottom 0.203: v35.05,23.88 36.32,25.15 36.32,25.91 v37.08,26.67
L6  (via drill 0.33)
  Top 0.203: L7.C 41.66,12.2 v41.66,19.56 | v41.66,23.11 41.66,26.16 41.15,26.67 U$3.413
  Bottom 0.203: v41.66,19.56 v41.66,23.11
L7  (via drill 0.33)
  Top 0.203: L8.C 51.2,9.65 45.72,9.65 42.67,12.7 v42.67,19.56 | v42.67,23.11 42.67,27.43 42.42,27.69 42.42,30.73 41.15,32 U$3.414
  Bottom 0.203: v42.67,19.56 v42.67,23.11
LB
  Top 0.203: U$3.113 39.12,68.52 39.12,62.23 38.72,61.83 RA8.3 RA9.6
LG
  Top 0.203: RA8.2 35.81,62.63 RA9.7 35.16,62.63 34.54,63.25 34.54,69.54 U$3.107
LR
  Top 0.203: RA9.8 36.58,63.43 | 36.58,63.43 RA8.1 | U$3.109 36.58,70.04 36.58,63.43
N$1
  Top 0.203: RA1.8 6.2,3.95 L1.A
N$2
  Top 0.203: RA1.7 13.6,4.94 12.39,6.15 L2.A
N$3
  Top 0.203: RA1.6 14.4,5 15.55,6.15 L3.A
N$4
  Top 0.203: RA1.5 22.8,3.95 L4.A
N$9
  Top 0.203: RA2.8 34.2,3.95 L5.A
N$10
  Top 0.203: RA2.7 41.6,5.14 40.64,6.1 39.05,6.1 L6.A
N$11
  Top 0.203: RA2.6 42.4,5.06 43.43,6.1 45.95,6.1 L7.A
N$12
  Top 0.203: RA2.5 45.35,3.95 47.5,6.1 52.95,6.1 L8.A
N$17
  Top 0.203: SW1.C 6.86,21.86 6.86,36.07 7.76,36.97 IC2.11
N$18
  Top 0.203: SW2.C 7.37,22.63 7.37,34.54 8.52,35.7 IC2.12
N$19
  Top 0.203: SW3.C 20.32,21.32 20.32,26.16 18.8,27.69 14.48,27.69 13.21,28.96 13.21,30.23 12.19,31.24 8.89,31.24 8.38,31.75 8.38,34.04 8.89,34.54 10.33,34.54 IC2.13
N$20
  Top 0.203: SW4.C 22.1,21.9 22.1,27.43 20.83,28.7 15.49,28.7 14.48,29.72 14.48,32.26 13.57,33.16 IC2.14
N$21
  Top 0.203: SW5.C 30.43,20.57 24.64,20.57 22.61,22.61 22.61,28.45 17.89,33.16 IC2.3
N$22
  Top 0.203: IC2.4 17.64,34.43 23.11,28.96 23.11,27.69 23.62,27.18 33.53,27.18 35.81,24.89 35.81,21.08 37.85,19.05 38.95,19.05 SW6.C
N$23
  Top 0.203: SW7.C 44.68,20.32 37.85,20.32 36.32,21.84 36.32,25.15 33.78,27.69 24.13,27.69 23.62,28.19 23.62,29.97 18.03,35.56 16.73,35.56 IC2.5 17.39,35.7
N$24  (via drill 0.33)
  Top 0.203: SW8.C v51.17,20.83 | IC2.6 17.89,36.97 24.13,30.73 24.13,28.7 24.64,28.19 34.04,28.19 36.83,25.4 36.83,22.35 38.35,20.83 v48.01,20.83
  Bottom 0.203: v48.01,20.83 v51.17,20.83
N$26
  Top 0.203: Q2.3 41.15,54.51 R21.1
N$27
  Top 0.203: Q3.3 37.08,54.58 R22.1
N$32
  Top 0.203: JP1.D- 7.18,50.92 C6.1 R2.1
N$33
  Top 0.203: JP1.D+ 9.88,50.27 10.49,50.88 10.49,53.09 11.4,54 R1.1 12.78,54.2 C5.1
N$34
  Top 0.203: U$2.8 15.54,52.27 14.28,53.54 R1.2
N$35
  Top 0.203: R2.2 11.87,52.27 U$2.9
N$36
  Top 0.203: L14.C R24.2
N$37
  Top 0.203: JP1.VBUS 3.82,51.57 3.56,51.31 3.56,48.51 3.81,48.26 9.14,48.26 | 9.14,48.26 11.21,50.33 U$2.12 | 9.14,48.26 9.14,46.98 C2.1
N$38
  Top 0.203: U$2.10 14.92,51.62 | 14.92,51.62 17.52,49.02 | 17.52,49.02 U$2.3 | 14.92,51.62 14.92,52.13 14.22,52.83 13.72,52.83 13.46,53.09 13.46,62.07 L14.A L15.A | 17.52,49.02 17.03,48.53 C1.1
N$39
  Top 0.203: R3.1 88.89,44.7 91.69,44.7 92.96,45.97 92.96,48.05 X2.14
N$40
  Top 0.203: R4.1 87.16,46.23 88.9,46.23 90.29,47.62 90.29,50.73 91.32,51.76 X2.13
N$44  (via drill 0.33)
  Top 0.203: RA7.5 62.74,17.41 v62.74,17.78 62.74,19.25 S1.1 | v64.01,11.43 64.17,11.26 IC1.10
  Bottom 0.203: v62.74,17.78 64.01,16.51 v64.01,11.43
N$45
  Top 0.203: S5.1 77.46,13.97 67.56,13.97 66.2,12.6 R23.2 64.39,12.7 60.2,12.7 59.09,11.6 IC1.14
N$46  (via drill 0.33)
  Top 0.203: S6.1 90.43,16.26 v88.39,14.22 | v88.39,12.7 88.39,11.18 85.85,8.64 67.82,8.64 65.79,7.11 61.21,7.11 59.09,4.99 IC1.3 58.93,3.27 58.93,2.29 58.67,2.03 53.85,2.03 51.86,4.02 RA6.4
  Bottom 0.203: v88.39,14.22 v88.39,12.7
N$47
  Top 0.203: S7.1 67.58,6.1 61.47,6.1 60.37,4.99 IC1.4 60.37,1.95 59.94,1.52 53.34,1.52 51.64,3.22 RA6.3
N$48
  Top 0.203: S8.1 78.08,5.59 62.23,5.59 61.63,4.99 IC1.5 61.63,1.69 60.96,1.02 53.09,1.02 51.68,2.42 RA6.2
N$49  (via drill 0.33)
  Top 0.203: Q10.3 91,78.93 89.15,81.41 85.09,81.41 84.33,82.17 84.33,83.95 v84.07,84.2
  Bottom 0.203: v84.07,84.2 84.07,97.02 L12.P$16
N$50  (via drill 0.33)
  Top 0.203: RA7.6 60.98,17.55 v61.21,17.78 61.21,19.81 68.07,26.67 78.34,26.67 S2.1 | v62.74,11.94 62.91,11.77 IC1.11
  Bottom 0.203: v61.21,17.78 62.74,16.26 v62.74,11.94
N$51  (via drill 0.33)
  Top 0.203: RA7.7 60.2,16.47 v60.2,17.78 60.2,22.1 65.28,27.18 88.83,27.18 S3.1 | v61.47,11.43 61.63,11.26 IC1.12
  Bottom 0.203: v60.2,17.78 61.47,16.51 v61.47,11.43
N$52  (via drill 0.33)
  Top 0.203: S4.1 67.98,15.49 v58.67,15.49 59.38,16.2 RA7.8 | v60.2,11.68 60.37,11.52 IC1.13
  Bottom 0.203: v58.67,15.49 60.2,13.97 v60.2,11.68
N$53
  Top 0.203: S9.1 88.57,5.08 63.75,5.08 62.91,4.23 IC1.6 62.91,1.18 62.23,0.51 52.11,0.51 RA6.1
N$55  (via drill 0.33)
  Top 0.203: Q11.3 95,79.89 96.27,81.15 98.55,81.15 99.31,81.92 99.31,94.87 v98.3,95.89
  Bottom 0.203: v98.3,95.89 97.91,95.89 L12.P$11
N$57
  Top 0.203: RA8.8 41.98,63.43 46.37,59.04 Q1.1
N$58
  Top 0.203: RA8.7 40.75,62.63 42.25,61.13 Q2.1
N$59
  Top 0.203: RA8.6 40.17,61.72 40.64,61.72 41.15,61.21 41.15,59.94 40.64,59.44 38.86,59.44 38.12,58.69 Q3.1
N$63
  Top 0.203: R20.2 46.76,48.91 L13.2
N$64
  Top 0.203: R21.2 43.85,47.5 49.53,47.5 49.89,47.86 L13.3
N$65
  Top 0.203: R22.2 37.93,51.05 46.74,51.05 47.08,50.71 L13.1
N$66
  Top 0.203: Q1.3 45.47,54.62 R20.1
N$69  (via drill 0.33)
  Top 0.203: Q9.3 87,78.86 85.6,80.9 77.72,80.9 75.95,82.68 v75.95,84.45
  Bottom 0.203: v75.95,84.45 75.95,92.45 L11.P$11
N$70  (via drill 0.33)
  Top 0.203: Q8.3 80.34,80.39 77.22,80.39 74.17,83.44 v74.17,84.45 | v69.09,96.65 69.09,98.42 68.33,99.19 58.73,99.19 L11.P$16
  Bottom 0.203: v74.17,84.45 74.17,91.57 v69.09,96.65
N$72  (via drill 0.33)
  Top 0.203: L9.P$1 1.78,82.87 1.78,88.52 3.81,90.55 v27.18,90.55 v52.58,90.55 v77.98,90.55 94.49,90.55 | RA10.8 31.64,77.7 L10.P$1
  Bottom 0.203: L10.P$1 27.14,90.51 v27.18,90.55 | L11.P$1 52.54,90.51 v52.58,90.55 | L12.P$1 77.94,90.51 v77.98,90.55
N$73  (via drill 0.33)
  Top 0.203: L9.P$2 4.28,87.72 6.35,89.79 v29.72,89.79 v55.12,89.79 v80.52,89.79 94.49,89.79 | RA10.7 39.04,78.56 37.59,79.76 32.63,79.88 L10.P$2
  Bottom 0.203: L10.P$2 29.68,89.75 v29.72,89.79 | L11.P$2 55.08,89.75 v55.12,89.79 | L12.P$2 80.48,89.75 v80.52,89.79
N$74  (via drill 0.33)
  Top 0.203: Q7.3 17.9,76.07 25.65,84.45 v30.99,84.45 | v33.53,96.9 33.53,98.68 34.29,99.44 43.55,99.44 L10.P$11
  Bottom 0.203: v30.99,84.45 30.99,94.36 v33.53,96.9
N$75  (via drill 0.33)
  Top 0.203: L9.P$4 9.36,88.23 10.16,89.03 v34.8,89.03 v60.2,89.03 v85.6,89.03 94.23,89.03 | RA10.6 39.84,78.52 38.61,80.64 36.95,80.64 L10.P$4
  Bottom 0.203: L10.P$4 34.76,88.99 v34.8,89.03 | L11.P$4 60.16,88.99 v60.2,89.03 | L12.P$4 85.56,88.99 v85.6,89.03
N$76  (via drill 0.33)
  Top 0.203: L9.P$5 11.9,87.21 12.95,88.27 v37.34,88.27 v62.74,88.27 v88.14,88.27 94.74,88.27 | RA10.5 40.64,78.99 37.69,82.83 L10.P$5
  Bottom 0.203: L10.P$5 37.3,88.23 v37.34,88.27 | L11.P$5 62.7,88.23 v62.74,88.27 | L12.P$5 88.1,88.23 v88.14,88.27
N$77  (via drill 0.33)
  Top 0.203: L9.P$6 14.44,86.45 15.49,87.5 v39.88,87.5 v65.28,87.5 v90.68,87.5 95.25,87.5 | RA11.8 45.23,80.14 42.16,80.14 39.84,82.46 L10.P$6
  Bottom 0.203: L10.P$6 39.84,87.47 v39.88,87.5 | L11.P$6 65.24,87.47 v65.28,87.5 | L12.P$6 90.64,87.47 v90.68,87.5
N$78  (via drill 0.33)
  Top 0.203: L9.P$7 16.98,85.69 18.03,86.74 v42.42,86.74 v67.82,86.74 v93.22,86.74 94.23,86.74 | RA11.7 47.33,78.65 46.23,80.64 44.57,80.64 L10.P$7
  Bottom 0.203: L10.P$7 42.38,86.7 v42.42,86.74 | L11.P$7 67.78,86.7 v67.82,86.74 | L12.P$7 93.18,86.7 v93.22,86.74
N$79  (via drill 0.33)
  Top 0.203: L9.P$8 19.52,85.18 20.32,85.98 v44.96,85.98 v70.36,85.98 v95.76,85.98 | RA11.6 48.13,80.27 47.24,81.15 46.6,81.15 L10.P$8
  Bottom 0.203: L10.P$8 44.92,85.94 v44.96,85.98 | L11.P$8 70.32,85.94 v70.36,85.98 | L12.P$8 95.72,85.94 v95.76,85.98
N$80  (via drill 0.33)
  Top 0.203: L9.P$9 22.06,84.42 22.86,85.22 v47.5,85.22 v72.9,85.22 95.88,85.22 L12.P$9 | RA11.5 48.93,81.36 L10.P$9
  Bottom 0.203: L10.P$9 47.46,85.18 v47.5,85.22 | L11.P$9 72.86,85.18 v72.9,85.22
N$81  (via drill 0.33)
  Top 0.203: L9.P$10 22.06,97.19 23.37,95.89 47.5,95.89 | 47.5,95.89 v49.02,95.89 72.9,95.89 | 72.9,95.89 96.07,95.89 L12.P$10 | L10.P$10 47.46,95.92 47.5,95.89 | L11.P$10 72.86,95.92 72.9,95.89 | RA12.8 52.8,78.26 49.28,82.68 v49.28,83.95
  Bottom 0.203: v49.28,83.95 49.28,95.63 v49.02,95.89
N$82  (via drill 0.33)
  Top 0.203: L9.P$12 16.98,96.18 18.03,95.12 v42.42,95.12 v50.8,95.12 v67.82,95.12 v93.22,95.12 94.74,95.12 | RA12.7 53.6,78.48 50.8,82.17 v50.8,84.45
  Bottom 0.203: L10.P$12 42.38,95.16 v42.42,95.12 | L11.P$12 67.78,95.16 v67.82,95.12 | L12.P$12 93.18,95.16 v93.22,95.12 | v50.8,84.45 v50.8,95.12
N$83  (via drill 0.33)
  Top 0.203: L9.P$13 14.44,95.42 15.49,94.36 v39.88,94.36 v56.9,94.36 v65.28,94.36 v90.68,94.36 95,94.36 | RA12.6 54.4,79.86 56.39,81.84 56.39,84.2 v56.9,84.45
  Bottom 0.203: L10.P$13 39.84,94.4 v39.88,94.36 | L11.P$13 65.24,94.4 v65.28,94.36 | L12.P$13 90.64,94.4 v90.68,94.36 | v56.9,84.45 v56.9,94.36
N$84  (via drill 0.33)
  Top 0.203: L9.P$14 11.9,94.91 13.21,93.6 v37.59,93.6 v58.42,93.6 v62.74,93.6 v88.14,93.6 95,93.6 | RA12.5 58.93,82.31 58.93,83.95 v58.42,84.45
  Bottom 0.203: L10.P$14 37.3,93.89 v37.59,93.6 | L11.P$14 62.7,93.64 v62.74,93.6 | L12.P$14 88.1,93.64 v88.14,93.6 | v58.42,84.45 v58.42,93.6
N$85  (via drill 0.33)
  Top 0.203: v9.4,91.31 v34.8,91.31 v60.45,91.31 v85.6,91.31 85.85,91.31 | RA13.8 60.59,80.79 61.47,81.66 v61.47,84.45
  Bottom 0.203: L9.P$15 9.36,91.35 v9.4,91.31 | L12.P$15 85.56,91.35 v85.6,91.31 | L10.P$15 34.76,91.35 v34.8,91.31 | L11.P$15 60.16,91.61 v60.45,91.31 61.47,90.3 v61.47,84.45
N$86  (via drill 0.33)
  Top 0.203: v5.33,92.08 v29.72,92.08 v55.12,92.08 v64.01,92.08 v80.52,92.08 94.23,92.08 | RA13.7 61.39,79.17 62.48,81.15 63.25,81.15 64.01,81.92 v64.01,84.2
  Bottom 0.203: L9.P$17 4.28,93.13 v5.33,92.08 | L10.P$17 29.68,92.11 v29.72,92.08 | L11.P$17 55.08,92.11 v55.12,92.08 | L12.P$17 80.48,92.11 v80.52,92.08 | v64.01,84.2 v64.01,92.08
N$87  (via drill 0.33)
  Top 0.203: 93.22,92.84 v77.98,92.84 v66.55,92.84 v52.58,92.84 v27.18,92.84 3.05,92.84 1.74,94.14 L9.P$18 | RA13.6 62.19,78.45 62.99,80.39 65.02,80.39 66.55,81.92 v66.55,84.45
  Bottom 0.203: L10.P$18 27.14,92.88 v27.18,92.84 | L11.P$18 52.54,92.88 v52.58,92.84 | L12.P$18 77.94,92.88 v77.98,92.84 | v66.55,84.45 v66.55,92.84
N$88  (via drill 0.33)
  Top 0.203: Q6.3 14.34,80.14 18.8,80.14 20.83,82.17 v20.83,84.71 | v24.38,98.17 25.65,99.44 30.85,99.44 L10.P$16
  Bottom 0.203: v20.83,84.71 24.38,88.27 v24.38,98.17
N$89
  Top 0.203: R25.2 L15.C
N$90  (via drill 0.33)
  Top 0.203: Q5.3 11.1,80.9 17.02,80.9 18.29,82.17 v18.29,85.22
  Bottom 0.203: v18.29,85.22 19.52,86.45 L9.P$11
N$91  (via drill 0.33)
  Top 0.203: Q4.3 2.9,77.58 5.59,80.9 5.59,86.49 6.86,87.76 v6.86,88.27 | v6.86,94.11 6.86,98.04 L9.P$16
  Bottom 0.203: v6.86,88.27 v6.86,94.11
N$93
  Top 0.203: RA15.6 88.51,70.48 90.05,72.02 Q10.1
N$94
  Top 0.203: RA15.5 92.28,69.68 94.05,71.44 Q11.1
N$95
  Top 0.203: RA15.8 82.05,72.75 Q8.1
N$96
  Top 0.203: RA15.7 84.23,71.28 86.05,73.1 Q9.1
N$97
  Top 0.203: RA14.6 11.71,72.22 Q6.1
N$98
  Top 0.203: RA14.5 14.91,73.02 Q7.1
N$99
  Top 0.203: RA14.8 5.31,70.62 Q4.1
N$100
  Top 0.203: RA14.7 8.51,71.42 Q5.1
RXD
  Top 0.203: U$2.1 23.34,47.73 30.99,55.37 U$3.105
S1  (via drill 0.33)
  Top 0.203: IC1.9 65.44,11.34 v65.79,11.68 | v59.44,18.8 59.44,22.35 54.1,27.69 50.8,27.69 50.04,28.45 50.04,30.73 49.53,31.24 47.75,31.24 47.5,31.5 47.5,35.31 v42.93,39.88 | IC2.10 8.75,38.24 8.13,38.86 8.13,40.39 11.18,43.43 39.37,43.43 v40.64,42.16
  Bottom 0.203: v65.79,11.68 65.79,16 63.25,18.54 59.69,18.54 v59.44,18.8 | v42.93,39.88 v40.64,42.16
SCLK  (via drill 0.33)
  Top 0.203: IC2.2 17.89,31.89 v18.29,31.5 | v23.37,36.32 v42.67,36.32 | IC1.2 57.83,5.17 v57.15,5.84 | v55.37,7.62 55.37,8.38 53.09,10.67 51.05,10.67 49.53,12.19 49.53,29.15 U$3.419 48.77,29.97 48.01,29.97 46.83,31.15 45.64,31.15 44.96,31.83 44.96,36.07 v44.7,36.32
  Bottom 0.203: v18.29,31.5 23.11,36.32 v23.37,36.32 | v42.67,36.32 v44.7,36.32 | v57.15,5.84 v55.37,7.62
SD0
  Top 0.203: U$3.102 23.44,70.62 RA14.1
SD1
  Top 0.203: U$3.104 26.86,74.68 25.15,74.68 21.89,71.42 RA14.2
SD2
  Top 0.203: U$3.106 28.9,75.18 24.64,75.18 21.67,72.22 RA14.3
SD3
  Top 0.203: U$3.108 30.93,75.69 24.13,75.69 21.45,73.02 RA14.4
SD4
  Top 0.203: U$3.132 66.87,75.95 75.95,75.95 77.98,73.91 77.98,73.15 79.05,72.08 RA15.1
SD5
  Top 0.203: U$3.134 68.9,75.44 75.69,75.44 77.47,73.66 77.47,72.64 78.84,71.28 RA15.2
SD6
  Top 0.203: U$3.136 70.93,74.93 75.44,74.93 76.96,73.41 76.96,71.88 78.37,70.48 RA15.3
SD7
  Top 0.203: U$3.138 72.96,74.42 75.18,74.42 76.45,73.15 76.45,71.12 77.9,69.68 RA15.4
SLD  (via drill 0.33)
  Top 0.203: IC2.1 18.91,30.62 v19.05,30.48 | v24.13,35.56 40.39,35.56 42.42,33.53 42.42,31.75 43.69,30.48 U$3.415 | 43.69,29.97 U$3.415 | IC1.1 56.55,5.17 v56.39,5.33 | v54.86,6.86 54.36,7.37 54.36,8.13 52.32,10.16 50.55,10.16 49.02,11.68 49.02,25.4 46.99,27.43 46.17,27.43 U$3.415
  Bottom 0.203: v19.05,30.48 v24.13,35.56 | v56.39,5.33 v54.86,6.86
SOUT  (via drill 0.33)
  Top 0.203: IC2.9 10.41,39.54 10.41,40.39 12.7,42.67 38.35,42.67 v38.86,42.16 | U$3.416 43.69,37.34 v41.4,39.62
  Bottom 0.203: v41.4,39.62 v38.86,42.16
SS1
  Top 0.203: U$3.110 36.07,74.93 37.19,75.8 RA10.1
SS2
  Top 0.203: U$3.114 39.04,74.94 RA10.2
SS4
  Top 0.203: U$3.116 42.36,74.42 40.64,74.42 39.84,74.96 RA10.3
SS5
  Top 0.203: U$3.115 44.96,71.82 44.96,74.17 43.08,75.8 RA10.4
SS6
  Top 0.203: U$3.118 46.53,73.39 RA11.1
SS7
  Top 0.203: U$3.117 47.5,71.82 47.5,74.42 47.33,74.59 RA11.2
SS8
  Top 0.203: U$3.120 48.13,73.73 RA11.3
SS9
  Top 0.203: U$3.119 50.04,71.82 50.04,73.91 48.93,74.77 RA11.4
SS10
  Top 0.203: U$3.122 51.31,74.56 RA12.1
SS12
  Top 0.203: U$3.121 52.58,71.82 52.58,74.17 53.6,74.94 RA12.2
SS13
  Top 0.203: U$3.124 54.4,73.64 RA12.3
SS14
  Top 0.203: U$3.123 55.12,71.82 55.12,74.68 55.2,74.76 RA12.4
SS15
  Top 0.203: RA13.1 58.27,75.8 56.39,73.92 U$3.126
SS17
  Top 0.203: U$3.125 57.66,71.82 57.66,73.91 58.67,74.93 60.96,74.93 61.39,75.36 RA13.2
SS18
  Top 0.203: U$3.128 60.26,74.42 61.72,74.42 62.19,74.89 RA13.3
TXD
  Top 0.203: U$2.4 19.92,49.67 20.32,49.28 21.08,49.28 25.91,54.1 U$3.101
VB0
  Top 0.203: U$3.431 65.28,31.18 65.28,33.53 65.79,34.04 68.33,34.04 70,35.71 R11.1
VB1
  Top 0.203: U$3.435 70.36,31.18 70.36,34.54 74,38.19 R5.1
VB2
  Top 0.203: U$3.436 69.09,34.04 72,36.95 R14.1
VB3
  Top 0.203: U$3.437 72.9,31.18 72.9,35.56 75.44,38.1 76.71,38.1 78,39.39 R8.1
VB4
  Top 0.203: U$3.438 71.63,35.05 76,39.42 R17.1
VBOUT
  Top 0.203: R11.2 R14.2 R5.2 R17.2 R8.2 81.28,45.13 81.28,49.02 84.02,51.76 X2.3
VG0
  Top 0.203: U$3.427 60.2,31.18 60.2,33.27 60.98,34.06 R12.1
VG1
  Top 0.203: U$3.428 58.98,32.5 R6.1
VG2
  Top 0.203: U$3.429 62.74,31.18 62.74,33.53 64.98,35.77 R15.1
VG3
  Top 0.203: U$3.430 61.47,33.28 62.98,34.79 R9.1
VG4
  Top 0.203: U$3.432 64.01,33.02 65.53,34.54 66.29,34.54 66.98,35.23 R18.1
VGOUT
  Top 0.203: R6.2 R12.2 R9.2 R15.2 R18.2 66.98,42.6 78.43,54.04 X2.2
VR0
  Top 0.203: U$3.420 49.7,33.38 R19.1
VR1
  Top 0.203: U$3.421 52.58,31.18 52.58,34.8 53.7,35.92 R13.1
VR2
  Top 0.203: U$3.422 51.7,32.84 R7.1
VR3
  Top 0.203: U$3.423 55.12,31.18 55.12,34.04 57.7,36.62 R16.1
VR4
  Top 0.203: U$3.424 53.85,34.04 55.7,35.89 R10.1
VROUT
  Top 0.203: R19.2 R7.2 R13.2 R10.2 R16.2 63.35,47.75 70.1,47.75 78.68,56.33 X2.1
VSYNC
  Top 0.203: U$3.439 76.9,29.91 81.03,34.04 R3.2

### Text on the board
tPlace: RX | TX | BeMicro CV shield / v1, 2015-05-03 | 1 | 2 | 3 | SW1 | SW2 | SW3 | SW4 | SW5 | SW6 | SW7 | SW8 | 4 | 5 | 6 | 7 | 8 | 9